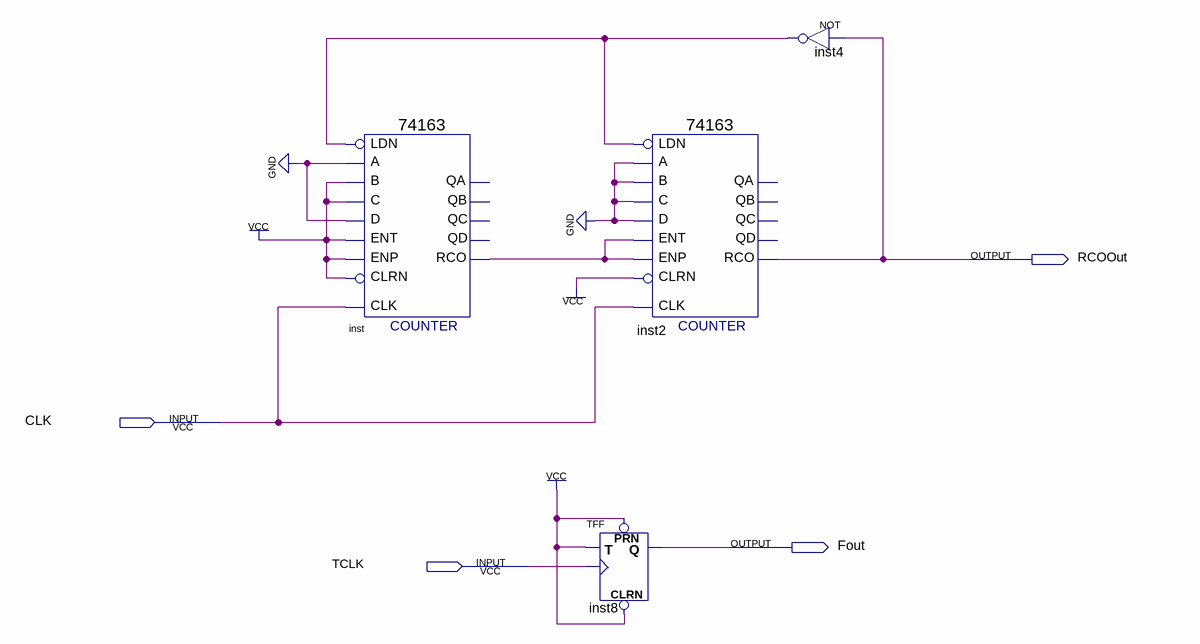
[diagram p0: schematic sheet]
// Quartus schematic Freqdivider100k.bdf as structural Verilog: 4 symbols, 4 pins
module Freqdivider100k (
  input  CLK,
  input  TCLK,
  output RCOOut,
  output Fout
);

  wire inst4_out, inst_rco;

  \74163  inst (
    .C(1'b1), .B(1'b1), .A(1'b0), .ENT(1'b1), .D(1'b0), .CLRN(1'b1), .CLK(CLK), .ENP(1'b1), .LDN(inst4_out),
    .RCO(inst_rco));  // open: QA, QB, QC, QD
  \74163  inst2 (
    .C(1'b0), .B(1'b0), .A(1'b0), .ENT(inst_rco), .D(1'b0), .CLRN(1'b1), .CLK(CLK), .ENP(inst_rco),
    .LDN(inst4_out), .RCO(RCOOut));  // open: QA, QB, QC, QD
  TFF inst8 (.PRN(1'b1), .CLRN(1'b1), .T(1'b1), .CLK(TCLK), .Q(Fout));
  not inst4 (inst4_out, RCOOut);
endmodule
